# EAGLE design schematic1 (EAGLE 9.6.2)
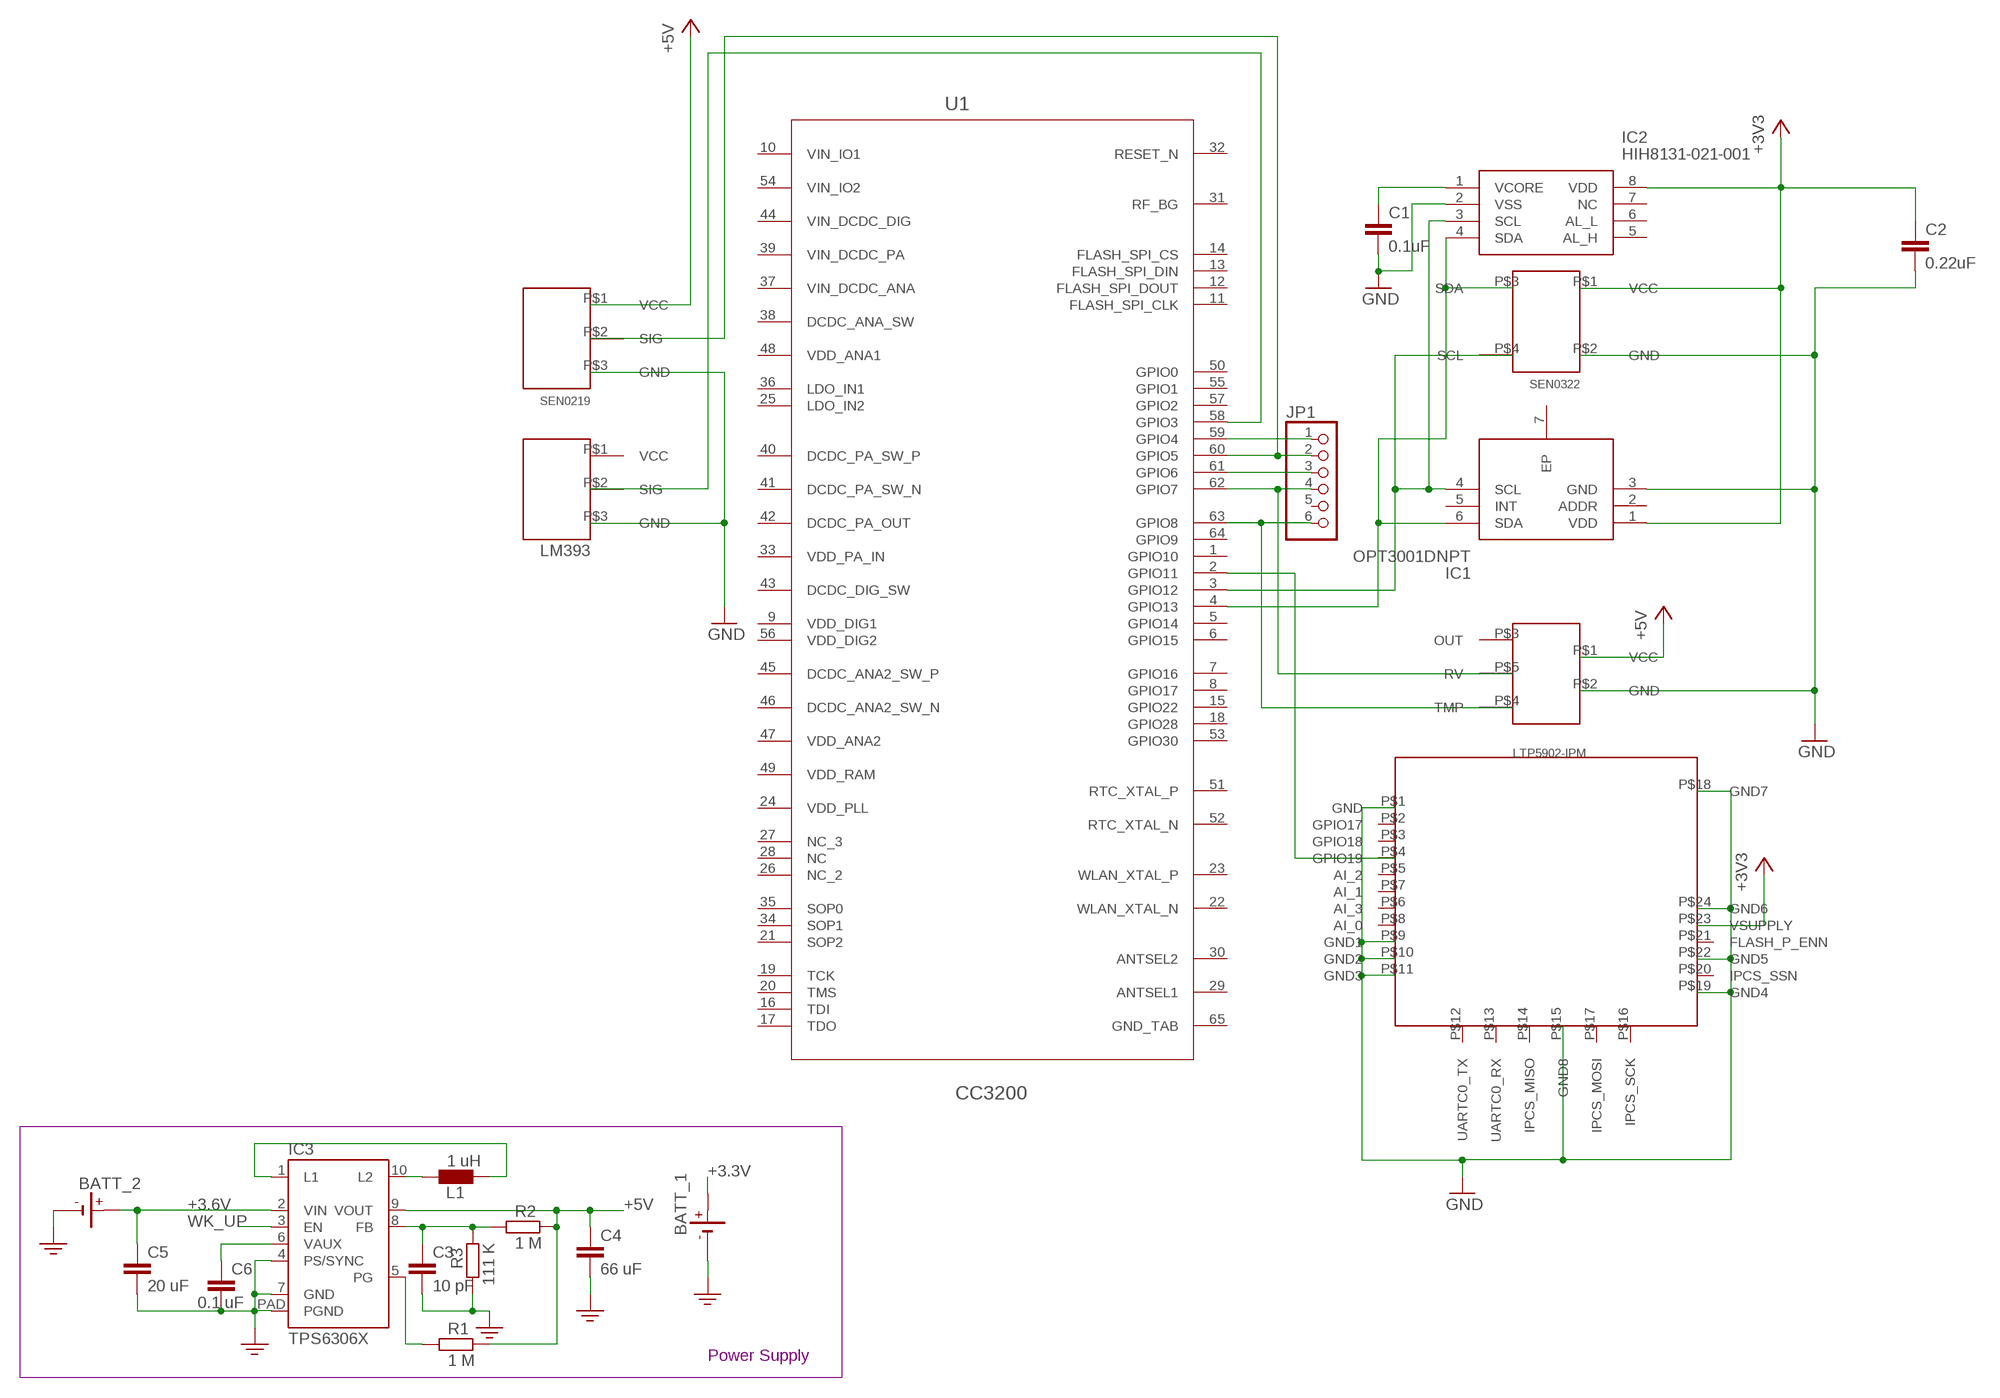
[diagram p0: schematic, sheet 1]

## Parts
BATT_1  BATTERY_BR1225/FA  [BATTERY_BR1225/FA]
BATT_2  BATTERY_BR1225/FA  [BATTERY_BR1225/FA]
C1  0.1uF  C2.5/2  [C2.5-2]
C2  0.22uF  C2.5/2  [C2.5-2]
C3  10 pF  CC1808  [C1808]
C4  66 uF  CC1808  [C1808]
C5  20 uF  CC1808  [C1808]
C6  0.1 uF  CC1808  [C1808]
IC1  OPT3001DNPT  [SON65P200X200X65-7N]
IC2  HIH8131-021-001  [SOIC127P600X206-8N]
IC3  TPS6306X  [S-PWSON-N10]
JP1  PINHD-1X6CB  [1X06-CLEANBIG]
L1  1 uH  L0204/7  [0204/7]
R1  1 M  RR2010  [R2010]
R2  1 M  RR2010  [R2010]
R3  111 K  RR2010  [R2010]
U1  CC3200  CC3200R1M2RGCR  [RGC0064A]
U2  WIND  [WIND]
U3  SEN0322  [SEN0322]
U4  SEN0219  [SEN0219]
U5  LM393  [LM393]
U6  LTP5902  [LTP5901]

## Nets
+3.3V [Power]: BATT_1.+
+3.6V: BATT_2.+ C5.1 IC3.2(VIN)
+3V3: C2.1 IC1.1(VDD) IC2.8(VDD) U3.P$1(VCC) U6.P$23(VSUPPLY)
+5V: C4.1 IC3.9(VOUT) R1.2 R2.2 U2.P$1(VCC) U4.P$1(VCC)
FB_TPS: C3.1 IC3.8(FB) R2.1 R3.2
GND: BATT_1.- BATT_2.- C1.2 C2.2 C3.2 C4.2 C5.2 C6.2 IC1.3(GND) IC2.2(VSS) IC3.4(PS/SYNC) IC3.7(GND) IC3.PAD(PGND) R3.1 U2.P$2(GND) U3.P$2(GND) U4.P$3(GND) U5.P$3(GND) U6.P$1(GND) U6.P$9(GND1) U6.P$10(GND2) U6.P$11(GND3) U6.P$15(GND8) U6.P$18(GND7) U6.P$19(GND4) U6.P$22(GND5) U6.P$24(GND6) ; supply symbol labelled GND2
L_TPS1: IC3.1(L1) L1.2
L_TPS2: IC3.10(L2) L1.1
N$1: JP1.1 U1.59(GPIO4)
N$2: JP1.2 U1.60(GPIO5) U4.P$2(SIG)
N$3: U1.2(GPIO11) U6.P$4(GPIO19)
N$4: U1.58(GPIO3) U5.P$2(SIG)
N$5: JP1.3 U1.61(GPIO6)
N$6: JP1.4 U1.62(GPIO7) U2.P$5(RV)
N$7: JP1.6 U1.63(GPIO8) U2.P$4(TMP)
N$8: C1.1 IC2.1(VCORE)
N$9: IC1.4(SCL) IC2.3(SCL) U1.3(GPIO12) U3.P$4(SCL)
N$10: IC1.6(SDA) IC2.4(SDA) U1.4(GPIO13) U3.P$3(SDA)
PG_TPS: IC3.5(PG) R1.1
VAUX_TPS: C6.1 IC3.6(VAUX)
WK_UP [Signals]: IC3.3(EN)
Unconnected: IC1.2(ADDR) IC1.5(INT) IC1.7(EP) IC2.5(AL_H) IC2.6(AL_L) IC2.7(NC) JP1.5 U1.1(GPIO10) U1.5(GPIO14) U1.6(GPIO15) U1.7(GPIO16) U1.8(GPIO17) U1.11(FLASH_SPI_CLK) U1.12(FLASH_SPI_DOUT) U1.13(FLASH_SPI_DIN) U1.14(FLASH_SPI_CS) U1.15(GPIO22) U1.16(TDI) U1.17(TDO) U1.18(GPIO28) U1.19(TCK) U1.20(TMS) U1.21(SOP2) U1.22(WLAN_XTAL_N) U1.23(WLAN_XTAL_P) U1.26(NC_2) U1.27(NC_3) U1.28(NC) U1.29(ANTSEL1) U1.30(ANTSEL2) U1.31(RF_BG) U1.32(RESET_N) U1.34(SOP1) U1.35(SOP0) U1.45(DCDC_ANA2_SW_P) U1.46(DCDC_ANA2_SW_N) U1.50(GPIO0) U1.51(RTC_XTAL_P) U1.52(RTC_XTAL_N) U1.53(GPIO30) U1.55(GPIO1) U1.57(GPIO2) U1.64(GPIO9) U2.P$3(OUT) U5.P$1(VCC) U6.P$2(GPIO17) U6.P$3(GPIO18) U6.P$5(AI_2) U6.P$6(AI_3) U6.P$7(AI_1) U6.P$8(AI_0) U6.P$12(UARTC0_TX) U6.P$13(UARTC0_RX) U6.P$14(IPCS_MISO) U6.P$16(IPCS_SCK) U6.P$17(IPCS_MOSI) U6.P$20(IPCS_SSN) U6.P$21(FLASH_P_ENN)

## Notes on the sheet
- Power Supply

## Power pins joined to a net without a drawn wire
DCDC_ANA_SW: U1.38(DCDC_ANA_SW)
DCDC_DIG_SW: U1.43(DCDC_DIG_SW)
DCDC_PA_OUT: U1.42(DCDC_PA_OUT)
DCDC_PA_SW_N: U1.41(DCDC_PA_SW_N)
DCDC_PA_SW_P: U1.40(DCDC_PA_SW_P)
GND_TAB: U1.65(GND_TAB)
LDO_IN1: U1.36(LDO_IN1)
LDO_IN2: U1.25(LDO_IN2)
VDD_ANA1: U1.48(VDD_ANA1)
VDD_ANA2: U1.47(VDD_ANA2)
VDD_DIG1: U1.9(VDD_DIG1)
VDD_DIG2: U1.56(VDD_DIG2)
VDD_PA_IN: U1.33(VDD_PA_IN)
VDD_PLL: U1.24(VDD_PLL)
VDD_RAM: U1.49(VDD_RAM)
VIN_DCDC_ANA: U1.37(VIN_DCDC_ANA)
VIN_DCDC_DIG: U1.44(VIN_DCDC_DIG)
VIN_DCDC_PA: U1.39(VIN_DCDC_PA)
VIN_IO1: U1.10(VIN_IO1)
VIN_IO2: U1.54(VIN_IO2)

## Library data of the parts
BATT_1 BATT_2 = 52101-101-REV-A_v16:BATTERY_BR1225/FA: BATT LITH COIN 3V
C1 C2 = capacitor-wima:C: CAPACITOR naming: grid - package width
C3-C6 = eagle-ltspice:C: CAPACITOR, European symbol; SPICEMODEL: NONE; SPICEPREFIX: C
IC1 = OPT3001DNPT:OPT3001DNPT: Texas Instruments OPT3001DNPT, Light Sensor IC, 850 nm I2C 1.6 3.6 V 6-Pin USON Source: Datasheet <http://www.ti.com/lit/ds/symlink/opt3001.pdf>; ARROW_PART_NUMBER: OPT3001DNPT; ARROW_PRICE-STOCK: https://www.arrow.com/en/products/opt3001dnpt/texas-instruments; DESCRIPTION: Texas Instruments OPT3001DNPT, Light Sensor IC, 850 nm I2C 1.6 3.6 V 6-Pin USON; HEIGHT: 0.65mm; MANUFACTURER_NAME: Texas Instruments; MANUFACTURER_PART_NUMBER: OPT3001DNPT; MOUSER_PART_NUMBER: 595-OPT3001DNPT; MOUSER_PRICE-STOCK: https://www.mouser.co.uk/ProductDetail/Texas-Instruments/OPT3001DNPT/?qs=bZA2O%252B%252B1GJuaPOlT9r7Pew%3D%3D
IC2 = HIH8131-021-001:HIH8131-021-001: Humidity/Temperature Sensor Digital Serial (I2C) 8-Pin SOIC T/R Source: Datasheet <https://www.mouser.co.uk/datasheet/2/187/hih8000-datasheet-009075-7-en-1140826.pdf>; ARROW_PART_NUMBER: HIH8131-021-001; ARROW_PRICE-STOCK: https://www.arrow.com/en/products/hih8131-021-001/honeywell; DESCRIPTION: Humidity/Temperature Sensor Digital Serial (I2C) 8-Pin SOIC T/R; HEIGHT: 2.055mm; MANUFACTURER_NAME: Honeywell; MANUFACTURER_PART_NUMBER: HIH8131-021-001; MOUSER_PART_NUMBER: 785-HIH8131-021-001; MOUSER_PRICE-STOCK: https://www.mouser.co.uk/ProductDetail/Honeywell/HIH8131-021-001?qs=jvB%252BdWhGd42knJA7wHeNmQ%3D%3D
IC3 = m_vreg:TPS6306X: TPS6306x High Input Voltage, Buck-Boost Converter With 2-A Switch Current Features Input Voltage Range: 2.5 V to 12 V Efficiency: Up to 93% Output Current at 5 V (VIN<10 V): 2 A in Buck Mode Output Current at 5 V (VIN>4 V): 1.3 A in Boost Mode Automatic Transition Between Step Down and Boost Mode Typical Device Quiescent Current: < 30 μA Fixed and Adjustable Output Voltage Options from 2.5 V to 8 V Power-Save Mode for Improved Efficiency at Low Output Power Forced Fixed-Frequency Operation at 2.4 MHz and Synchronization Possible Power Good Output Buck-Boost Overlap ControlTM Load Disconnect During Shutdown Overtemperature Protection Overvoltage Protection Description The TPS6306x devices provide a power supply solution for products powered by either three-cell up to six-cell alkaline, NiCd or NiMH battery, or a one- cell or dual-cell Li-Ion or Li-polymer battery. Output currents can go as high as 2-A while using a dual-cell Li-Ion or Li-polymer battery, and discharge it down to 5 V or lower. The buck-boost converter is based on a fixed frequency, pulse-width-modulation (PWM) controller using synchronous rectification to obtain maximum efficiency. At low load currents, the converter enters power-save mode to maintain high efficiency over a wide load current range. The power- save mode can be disabled, forcing the converter to operate at a fixed switching frequency. The maximum average current in the switches is limited to a typical value of 2.25 A. The output voltage is programmable using an external resistor divider, or is fixed internally on the chip. The converter can be disabled to minimize battery drain. During shutdown, the load is disconnected from the battery. The devices are available in a 3 mm × 3 mm, 10-pin, WSON (DSC), PowerPADTM package. Information based on TI document SLVSA92B – DECEMBER 2011 – REVISED DECEMBER 2014 Added 2016-07-24; MANUF: TI; PARTNUM: TPS6306X
JP1 = adafruit:PINHD-1X6: PIN HEADER
L1 = eagle-ltspice:L: INDUCTOR, European symbol; SPICEMODEL: NONE; SPICEPREFIX: L
R1-R3 = eagle-ltspice:R: RESISTOR, European symbol; SPICEMODEL: NONE; SPICEPREFIX: R
U1 = CC3200:CC3200R1M2RGCR; ALTERNATEPARTNUMBER: CC3200R1M2RGC; COMPTYPE: IC; MANUFACTURER: Texas Instruments; MOUNTTYPE: SMT; PACKAGEREFERENCE: RGC0064A; PARTNUMBER: CC3200R1M2RGCR; PIN_COUNT: 65; REFDES: RefDes; ROHS: Y; TYPE: TYPE; VALUE: Value
U2 = WINDc:WIND
U3 = SEN0322c:SEN0322
U4 = SEN0219c:SEN0219
U5 = LM393c:LM393
U6 = LTP5902c:LTP5902

## Board
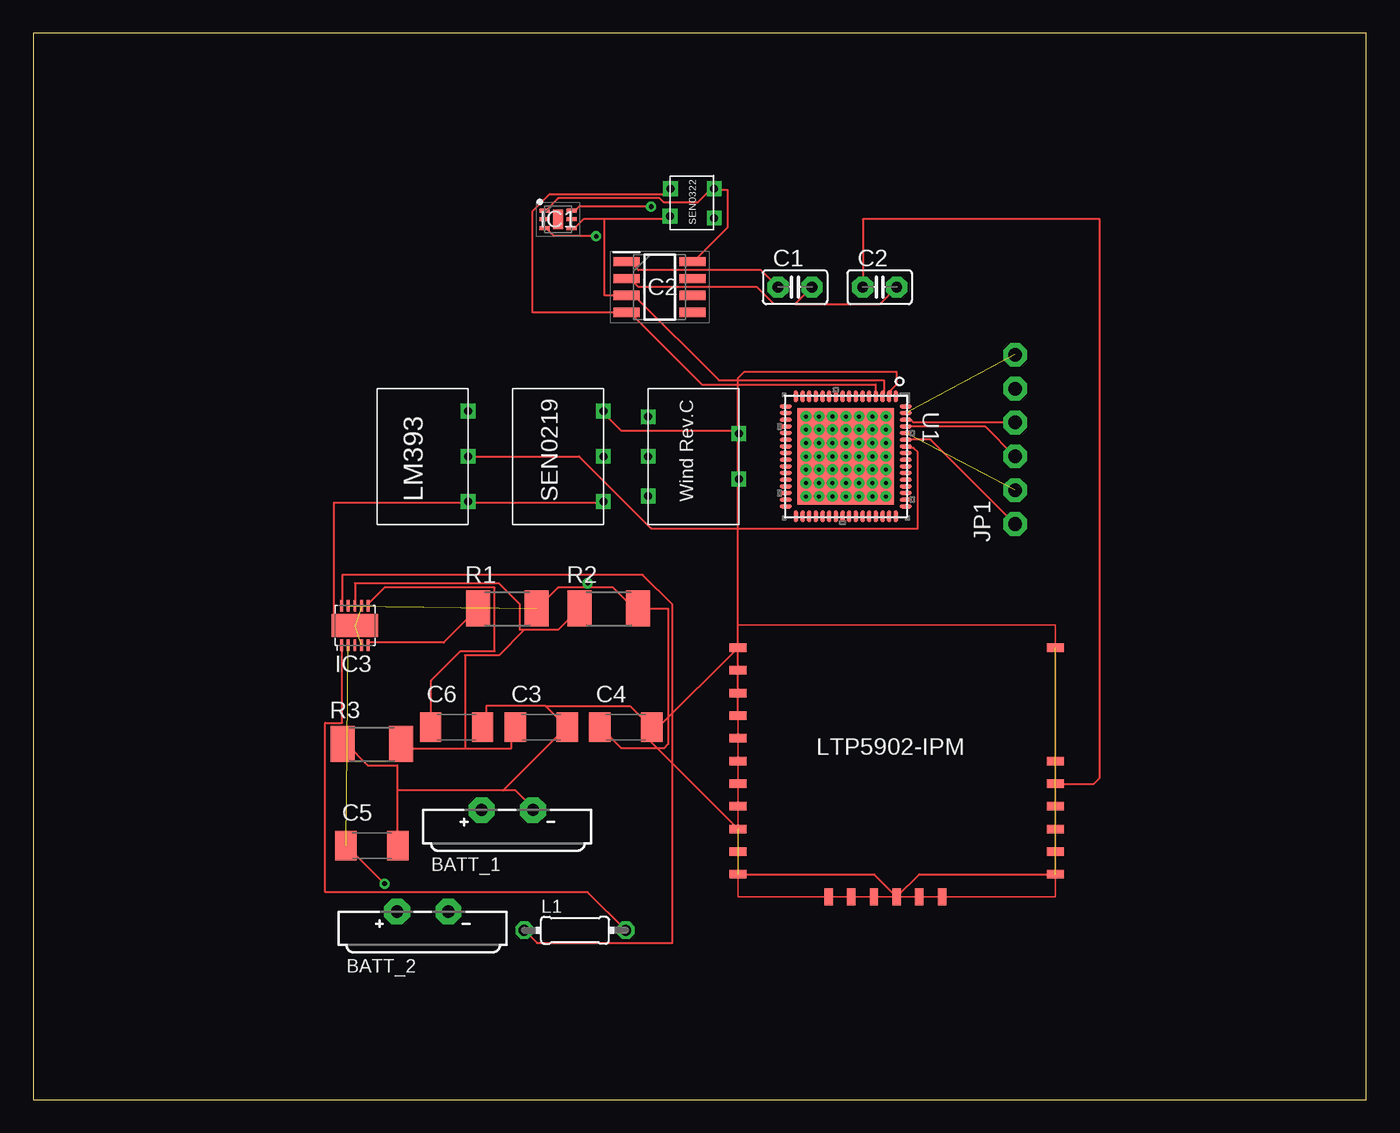
[diagram p1: board, top side]
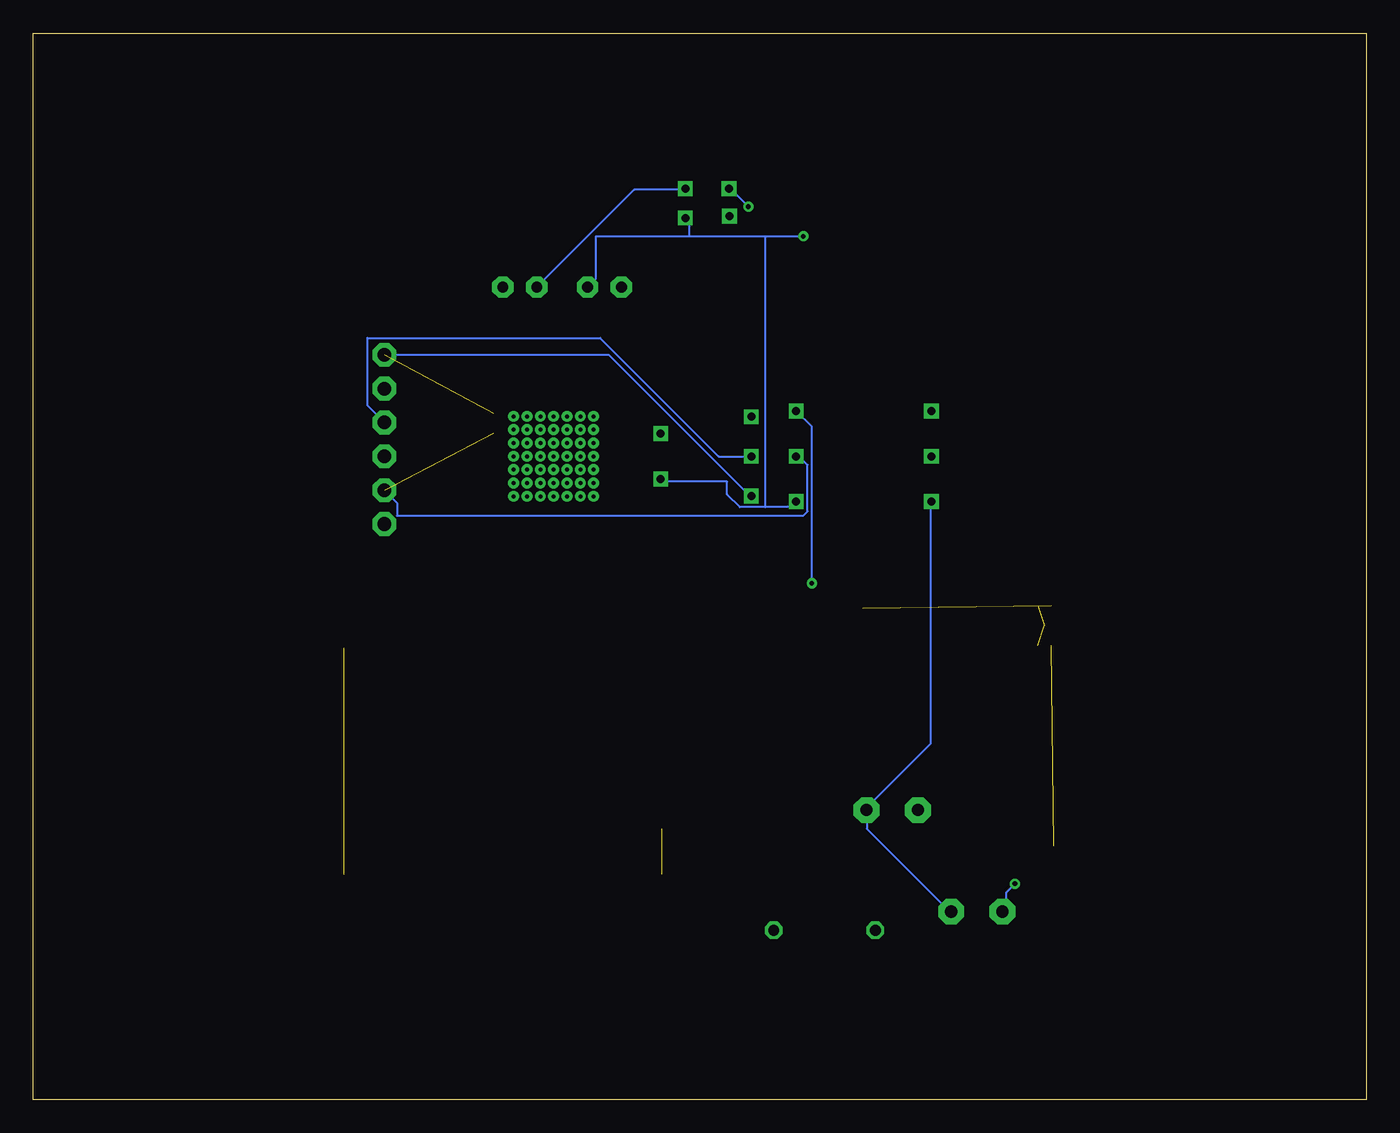
[diagram p2: board, bottom side, seen from below]

Size 100 x 80 mm. Coordinates in mm from the lower left corner, seen from the top.
Outline: 0,0 100,0 100,80 0,80 0,0
Copper layers (1*16): Top 0.035mm / dielectric 1.5mm / Bottom 0.035mm
Design rules "default": minimum track width 6mil, minimum drill 0.35mm, track to track 6mil, track to pad 6mil, pad to pad 6mil, via to via 6mil, smd to smd 6mil, copper to edge 40mil, drill to drill 6mil, minimum pad ring 10mil, minimum via ring 8mil, stop-mask expansion 4mil, vias tented up to drill 0mil, thermal gap 10mil

### Footprints (pad centres in the part's own frame; a part is rotated, then mirrored left to right if it is on the bottom)
BATTERY_BR1225/FA = drill 0.914 pad 1.93 octagon: + -1.925,1.4; - 1.925,1.4
C2.5-2 = drill 0.813 pad 1.6 octagon: 1 -1.27,0; 2 1.27,0
C1808 = smd 1.6 x 2.2: 1 -1.95,0; 2 1.95,0
SON65P200X200X65-7N = smd 0.75 x 0.3: 1 -1,0.65; 2 -1,0; 3 -1,-0.65; 4 1,-0.65; 5 1,0; 6 1,0.65 | smd 0.75 x 1.45: 7 0,0
SOIC127P600X206-8N = smd 1.95 x 0.7: 1 -2.475,1.905; 2 -2.475,0.635; 3 -2.475,-0.635; 4 -2.475,-1.905; 5 2.475,-1.905; 6 2.475,-0.635; 7 2.475,0.635; 8 2.475,1.905
S-PWSON-N10 = smd 0.28 x 0.85: 1 -1,-1.475; 2 -0.5,-1.475; 3 0,-1.475; 4 0.5,-1.475; 5 1,-1.475; 6 1,1.475; 7 0.5,1.475; 8 0,1.475; 9 -0.5,1.475; 10 -1,1.475 | smd 3.55 x 1.7: PAD 0,0
1X06-CLEANBIG = drill 1.016 pad 1.778 octagon: 1 -6.35,0; 2 -3.81,0; 3 -1.27,0; 4 1.27,0; 5 3.81,0; 6 6.35,0
0204/7 = drill 0.813 octagon: 1 -3.81,0; 2 3.81,0
R2010 = smd 1.8 x 2.7: 1 -2.2,0; 2 2.2,0
RGC0064A = smd 0.9 x 0.3: 1 -4.5,3.75; 2 -4.5,3.25; 3 -4.5,2.75; 4 -4.5,2.25; 5 -4.5,1.75; 6 -4.5,1.25; 7 -4.5,0.75; 8 -4.5,0.25; 9 -4.5,-0.25; 10 -4.5,-0.75; 11 -4.5,-1.25; 12 -4.5,-1.75; 13 -4.5,-2.25; 14 -4.5,-2.75; 15 -4.5,-3.25; 16 -4.5,-3.75; 33 4.5,-3.75; 34 4.5,-3.25; 35 4.5,-2.75; 36 4.5,-2.25; 37 4.5,-1.75; 38 4.5,-1.25; 39 4.5,-0.75; 40 4.5,-0.25; 41 4.5,0.25; 42 4.5,0.75; 43 4.5,1.25; 44 4.5,1.75; 45 4.5,2.25; 46 4.5,2.75; 47 4.5,3.25; 48 4.5,3.75 | smd 0.3 x 0.9: 17 -3.75,-4.5; 18 -3.25,-4.5; 19 -2.75,-4.5; 20 -2.25,-4.5; 21 -1.75,-4.5; 22 -1.25,-4.5; 23 -0.75,-4.5; 24 -0.25,-4.5; 25 0.25,-4.5; 26 0.75,-4.5; 27 1.25,-4.5; 28 1.75,-4.5; 29 2.25,-4.5; 30 2.75,-4.5; 31 3.25,-4.5; 32 3.75,-4.5; 49 3.75,4.5; 50 3.25,4.5; 51 2.75,4.5; 52 2.25,4.5; 53 1.75,4.5; 54 1.25,4.5; 55 0.75,4.5; 56 0.25,4.5; 57 -0.25,4.5; 58 -0.75,4.5; 59 -1.25,4.5; 60 -1.75,4.5; 61 -2.25,4.5; 62 -2.75,4.5; 63 -3.25,4.5; 64 -3.75,4.5 | smd 7.25 x 7.25: 65 0,0 | drill 0.3: V 3,3; V_1 3,1; V_2 -3,2; V_3 -3,0; V_4 -2,2; V_5 -3,3; V_6 -3,1; V_7 -2,3; V_8 -3,-3; V_9 -2,1; V_10 -3,-2; V_11 -3,-1; V_12 2,2; V_13 3,2; V_14 2,1; V_15 -1,1; V_16 0,1; V_17 1,1; V_18 1,3; V_19 -1,3; V_20 0,3; V_21 2,3; V_22 1,2; V_23 -1,2; V_24 0,2; V_25 -2,0; V_26 -1,0; V_27 0,0; V_28 1,0; V_29 2,0; V_30 3,0; V_31 -2,-1; V_32 -2,-2; V_33 -2,-3; V_34 -1,-1; V_35 -1,-2; V_36 -1,-3; V_37 0,-1; V_38 0,-2; V_39 0,-3; V_40 1,-1; V_41 1,-2; V_42 1,-3; V_43 2,-1; V_44 2,-2; V_45 2,-3; V_46 3,-1; V_47 3,-2; V_48 3,-3
WIND = drill 0.6 square: P$1 3.4,1.7; P$2 3.4,-1.7; P$3 -3.4,2.97; P$4 -3.4,-2.97; P$5 -3.4,0
SEN0322 = drill 0.6 square: P$1 1.554,1.036; P$2 1.554,-1.166; P$3 -1.727,1.036; P$4 -1.77,-1.036
SEN0219 = drill 0.6 square: P$1 3.4,3.4; P$2 3.4,0; P$3 3.4,-3.4
LM393 = drill 0.6 square: P$1 3.4,3.4; P$2 3.4,0; P$3 3.4,-3.4
LTP5901 = smd 1.27 x 0.635: P$1 -11.9,8.5; P$2 -11.9,6.8; P$3 -11.9,5.1; P$4 -11.9,3.4; P$5 -11.9,1.7; P$6 -11.9,-1.7; P$7 -11.9,0; P$8 -11.9,-3.4; P$9 -11.9,-5.1; P$10 -11.9,-6.8; P$11 -11.9,-8.5; P$18 11.9,8.5; P$19 11.9,-8.5; P$20 11.9,-6.8; P$21 11.9,-3.4; P$22 11.9,-5.1; P$23 11.9,-1.7; P$24 11.9,0 | smd 0.635 x 1.27: P$12 -5.1,-10.2; P$13 -3.4,-10.2; P$14 -1.7,-10.2; P$15 0,-10.2; P$16 3.4,-10.2; P$17 1.7,-10.2

### Placement (x,y rotation side)
BATT_1  35.56,20.32 0 top
BATT_2  29.21,12.7 0 top
C1  57.15,60.96 0 top
C2  63.5,60.96 0 top
C3  38.1,27.94 0 top
C4  44.45,27.94 0 top
C5  25.4,19.05 0 top
C6  31.75,27.94 0 top
IC1  39.37,66.04 0 top
IC2  46.99,60.96 0 top
IC3  24.13,35.56 0 top
JP1  73.66,49.53 90 top
L1  40.64,12.7 0 top
R1  35.56,36.83 0 top
R2  43.18,36.83 0 top
R3  25.4,26.67 0 top
U1  60.96,48.26 270 top
U2  49.53,48.26 0 top
U3  49.53,67.31 0 top
U4  39.37,48.26 0 top
U5  29.21,48.26 0 top
U6  64.77,25.4 0 top

### Tracks (layer width: path | path; a pad name or v marks a point on that pad's centre or on a via)
+3.6V  (via drill 0.35)  (1 unrouted)
  Top 0.152: v26.35,16.19 23.5,19.05 C5.1
  Bottom 0.152: v26.35,16.19 26.99,15.56 26.99,14.29 BATT_2.+
+3V3
  Top 0.152: IC1.1 38.42,66.67 39.37,67.63 46.99,67.63 47.31,67.31 49.85,67.31 50.8,68.26 U3.P$1 51.12,68.26 52.07,68.26 52.07,65.41 49.53,62.87 IC2.8 | U6.P$23 79.58,23.7 80.01,24.13 80.01,66.04 62.23,66.04 C2.1
  Bottom 0.152: C2.1 54.93,68.26 51.12,68.26 U3.P$1
+5V  (via drill 0.35)  (1 unrouted)
  Top 0.152: U4.P$1 42.86,51.44 44.13,50.16 52.7,50.16 U2.P$1 | C4.1 42.55,27.94 44.13,26.35 47.31,26.35 47.62,26.67 47.62,36.83 R2.2 45.09,36.83 43.5,38.42 41.59,38.42 | 41.59,38.42 39.37,38.42 37.78,36.83 R1.2 | 41.59,38.42 v41.59,38.73
  Bottom 0.152: U4.P$1 41.59,50.48 v41.59,38.73
FB_TPS
  Top 0.152: 32.38,26.35 27.94,26.35 27.62,26.67 R3.2 | 32.38,26.35 35.88,26.35 35.88,27.94 C3.1 | IC3.8 24.13,38.73 34.92,38.73 36.51,37.15 36.51,35.24 36.83,35.24 | 36.83,35.24 39.37,35.24 40.96,36.83 R2.1 | 32.38,26.35 32.38,33.34 34.92,33.34 36.83,35.24
GND  (via drill 0.35)  (7 unrouted)
  Top 0.152: 38.42,29.53 33.97,29.53 33.97,27.94 C6.2 | 40.01,27.94 38.42,29.53 | 46.04,28.26 44.77,29.53 38.42,29.53 | 46.04,28.26 46.35,27.94 C4.2 | 27.3,23.18 27.3,25.08 25.08,25.08 23.5,26.67 R3.1 | 27.3,23.18 27.3,19.05 C5.2 | 35.24,23.18 36.2,23.18 37.47,21.91 BATT_1.- | 35.24,23.18 27.3,23.18 | 35.24,23.18 40.01,27.94 | 40.01,27.94 C3.2 | v42.23,64.77 39.05,64.77 38.42,65.41 IC1.3 | 57.15,59.69 55.56,59.69 54.29,60.96 45.4,60.96 44.77,61.59 IC2.2 | C1.2 57.15,59.69 | C2.2 63.5,59.69 57.15,59.69 | U4.P$3 42.55,44.77 32.7,44.77 U5.P$3 32.38,44.77 22.54,44.77 22.54,36.51 22.86,36.2 23.5,36.2 IC3.PAD | U6.P$9 46.04,27.13 46.04,27.94 | 46.04,27.94 46.04,28.26 | U6.P$1 46.91,27.94 46.04,27.94 | U6.P$11 63.07,16.9 U6.P$15 66.47,16.9 U6.P$19
  Bottom 0.152: BATT_2.- 31.43,14.29 37.47,20.32 37.47,21.59 BATT_1.- 37.47,21.91 32.7,26.67 32.7,44.77 U5.P$3 | 50.8,64.77 45.09,64.77 | 45.09,64.77 v42.23,64.77 | 50.8,64.77 50.8,66.04 U3.P$2 | 50.8,64.77 57.78,64.77 57.78,61.59 C1.2 | 45.09,44.45 42.86,44.45 42.86,44.77 U4.P$3 | 45.09,44.45 46.99,44.45 47.94,45.4 47.94,46.35 52.7,46.35 U2.P$2 | 45.09,44.45 45.09,64.77
L_TPS1
  Top 0.152: L1.2 41.59,15.56 21.91,15.56 21.91,28.26 23.18,28.26 23.18,33.97 IC3.1
L_TPS2
  Top 0.152: L1.1 37.78,11.75 47.94,11.75 47.94,37.15 45.72,39.37 23.18,39.37 23.18,37.15 IC3.10
N$1
  Top 0.152: JP1.1 67.31,49.53 65.72,49.53 U1.59
N$2  (1 unrouted)
  Bottom 0.152: JP1.2 72.71,44.77 72.71,43.81 42.23,43.81 41.91,44.13 41.91,47.62 42.55,48.26 U4.P$2
N$3
  Top 0.152: U6.P$4 52.87,54.14 53.34,54.61 64.77,54.61 64.77,53.66 64.33,53.22 64.33,52.88 U1.2
N$4
  Top 0.152: U5.P$2 40.96,48.26 46.35,42.86 66.36,42.86 66.36,48.58 66.04,48.9 65.72,48.9 U1.58
N$5
  Top 0.152: JP1.3 71.44,50.48 65.72,50.48 U1.61
N$6
  Top 0.152: JP1.4 66.04,50.8 65.72,51.12 U1.62
  Bottom 0.152: U2.P$5 48.58,48.26 57.47,57.15 74.93,57.15 74.93,52.07 JP1.4
N$7  (1 unrouted)
  Bottom 0.152: JP1.6 56.83,55.88 46.35,45.4 U2.P$4
N$8
  Top 0.152: C1.1 54.61,62.23 45.4,62.23 44.77,62.87 IC2.1
N$9
  Top 0.152: 42.86,66.04 47.62,66.04 U3.P$4 | 42.86,66.04 41.27,66.04 40.64,65.41 IC1.4 | U1.3 63.82,53.02 63.82,53.98 51.44,53.98 45.09,60.33 IC2.3 42.86,60.33 42.86,66.04
N$10  (via drill 0.35)
  Top 0.152: v46.35,66.99 40.96,66.99 40.64,66.67 IC1.6 | U1.4 63.18,53.02 63.18,53.66 50.16,53.66 44.77,59.05 IC2.4 37.47,59.05 37.47,66.67 38.73,67.94 47.31,67.94 47.62,68.26 U3.P$3
  Bottom 0.152: v46.35,66.99 47.62,68.26 U3.P$3
PG_TPS
  Top 0.152: IC3.5 25.08,34.29 30.8,34.29 33.34,36.83 R1.1
VAUX_TPS
  Top 0.152: IC3.6 25.08,37.15 26.35,38.42 34.61,38.42 34.61,33.66 32.07,33.66 29.84,31.43 29.84,27.94 C6.1